# EAGLE design [B]Main board v1.4 (EAGLE 7.1.0)
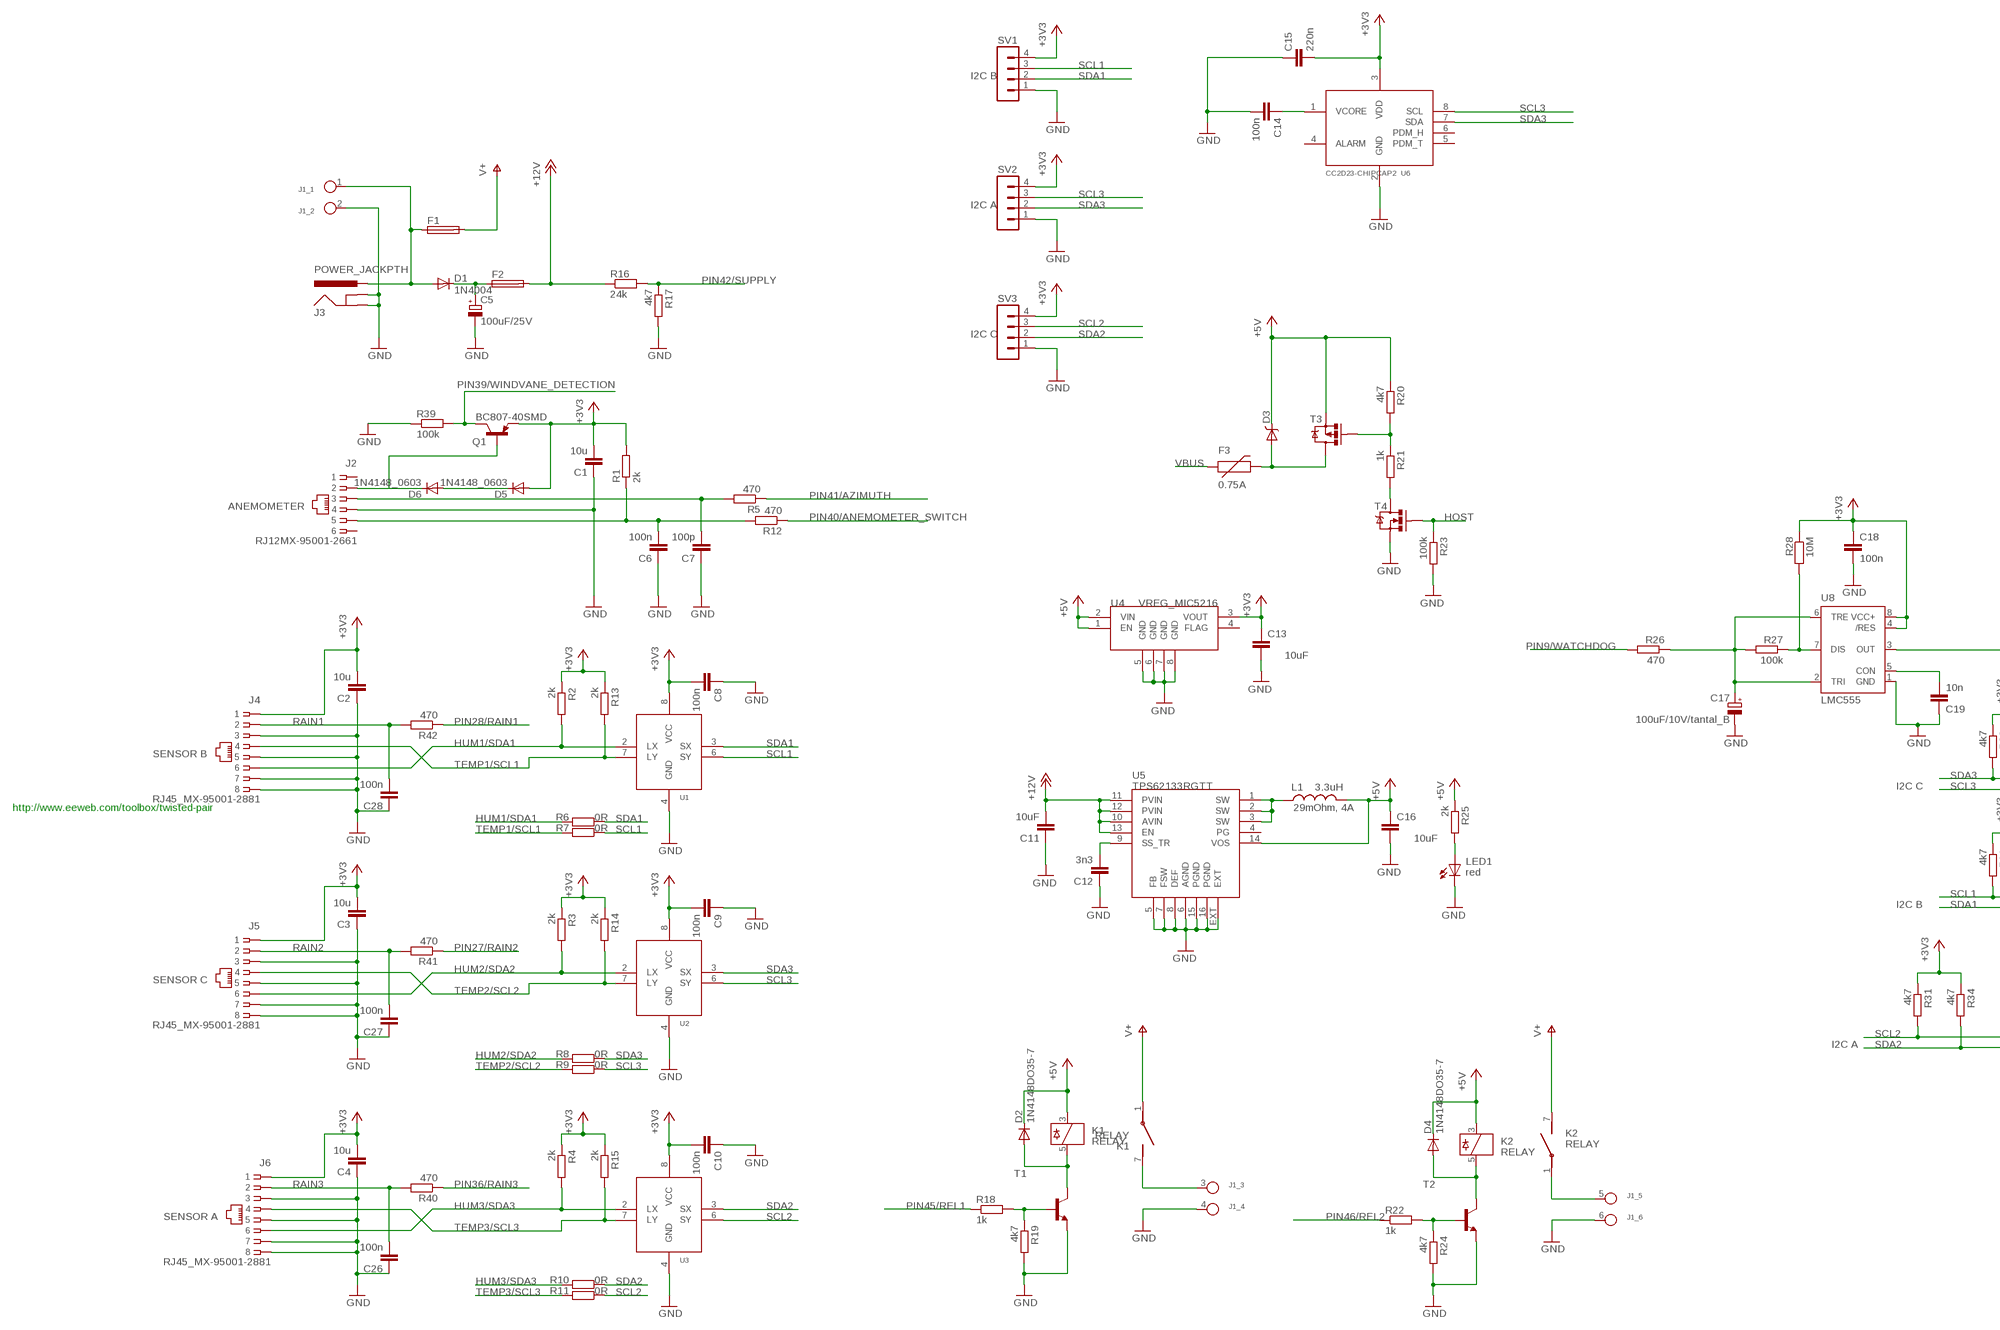
[diagram p0: schematic, sheet 1, part 1 of 2]
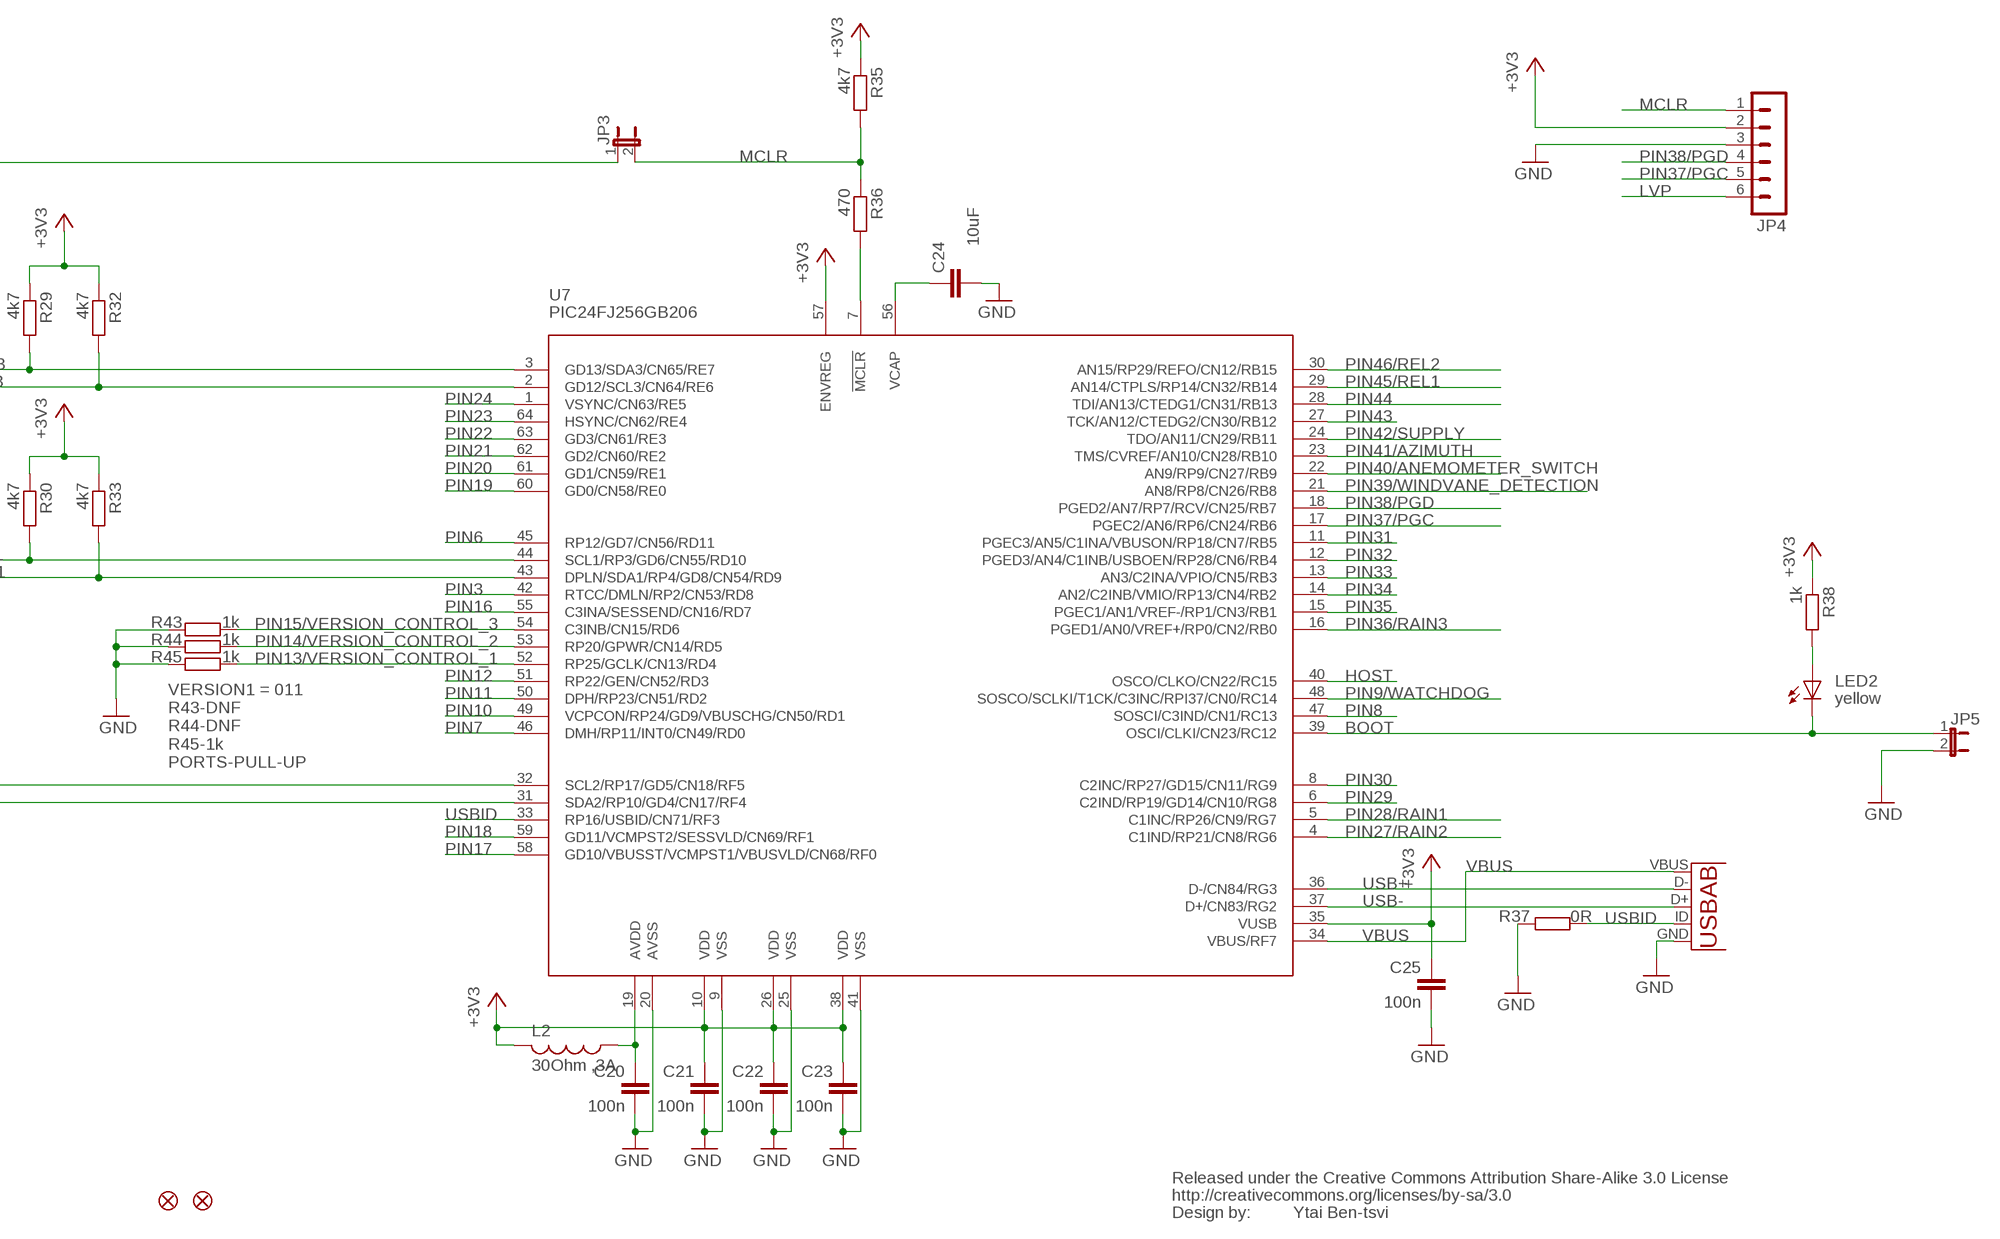
[diagram p1: schematic, sheet 1, part 2 of 2]

## Parts
C1  10u  C-EUC1206  [C1206]
C2  10u  C-EUC1206  [C1206]
C3  10u  C-EUC1206  [C1206]
C4  10u  C-EUC1206  [C1206]
C5  100uF/25V  CPOL-EUE2-5  [E2-5]
C6  100n  C-EUC1206  [C1206]
C7  100p  C-EUC1206  [C1206]
C8  100n  C-EUC1206  [C1206]
C9  100n  C-EUC1206  [C1206]
C10  100n  C-EUC1206  [C1206]
C11  10uF  C-EUC1206  [C1206]
C12  3n3  C-EUC1206  [C1206]
C13  10uF  C-EUC1206  [C1206]
C14  100n  C-EUC1206  [C1206]
C15  220n  C-EUC1206  [C1206]
C16  10uF  C-EUC1206  [C1206]
C17  100uF/10V/tantal_B  CPOL-EUB/3528-21R  [B/3528-21R]
C18  100n  C-EUC1206  [C1206]
C19  10n  C-EUC1206  [C1206]
C20  100n  C-EUC1206  [C1206]
C21  100n  C-EUC1206  [C1206]
C22  100n  C-EUC1206  [C1206]
C23  100n  C-EUC1206  [C1206]
C24  10uF  C-EUC1206  [C1206]
C25  100n  C-EUC1206  [C1206]
C26  100n  C-EUC1206  [C1206]
C27  100n  C-EUC1206  [C1206]
C28  100n  C-EUC1206  [C1206]
D1  1N4004  [DO41-10]
D2  1N4148DO35-7  [DO35-7]
D3  B340A  DIODE-SCHOTTKY_  [SMA-DIODE]
D4  1N4148DO35-7  [DO35-7]
D5  1N4148_0603  [D0603]
D6  1N4148_0603  [D0603]
F1  FUSE_HOLDER  [ZHL30]
F2  FUSE_HOLDER  [ZHL30]
F3  PTCSMD  [PTC-1206]
J1  6P_CONN  [MOLEX_39543-0006]
J2  RJ12MX-95001-2661  [MX-95001-2661]
J3  POWER_JACKPTH  [PC-GK2.1]
J4  RJ45_MX-95001-2881  [MX-95001-2881]
J5  RJ45_MX-95001-2881  [MX-95001-2881]
J6  RJ45_MX-95001-2881  [MX-95001-2881]
J7  10104111-0001LF  USB_AB  [USB-AB-MICRO-SMD]
JP1  FIDUCIALUFIDUCIAL  [MICRO-FIDUCIAL]
JP2  FIDUCIALUFIDUCIAL  [MICRO-FIDUCIAL]
JP3  JUMPER-2PTH  [1X02]
JP4  MA06-1  [MA06-1]
JP5  JUMPER-2PTH  [1X02]
K1  RELAY  [JV-5S-KT]
K2  RELAY  [JV-5S-KT]
L1  VLC5045T-3R3N  INDUCTORCR54  [CR54]
L2  30Ohm ,3A  L-US  [R1206]
LED1  LS L29K-G1J2-1-Z  LED1206  [LED-1206]
LED2  LY L29K-J1K2-26-Z  LED1206  [LED-1206]
Q1  BC807-40SMD  [SOT23-BEC]
R1  2k  R-EU_R1206  [R1206]
R2  2k  R-EU_R1206  [R1206]
R3  2k  R-EU_R1206  [R1206]
R4  2k  R-EU_R1206  [R1206]
R5  470  R-EU_R1206  [R1206]
R6  0R  R-EU_R1206  [R1206]
R7  0R  R-EU_R1206  [R1206]
R8  0R  R-EU_R1206  [R1206]
R9  0R  R-EU_R1206  [R1206]
R10  0R  R-EU_R1206  [R1206]
R11  0R  R-EU_R1206  [R1206]
R12  470  R-EU_R1206  [R1206]
R13  2k  R-EU_R1206  [R1206]
R14  2k  R-EU_R1206  [R1206]
R15  2k  R-EU_R1206  [R1206]
R16  24k  R-EU_R1206  [R1206]
R17  4k7  R-EU_R1206  [R1206]
R18  1k  R-EU_R1206  [R1206]
R19  4k7  R-EU_R1206  [R1206]
R20  4k7  R-EU_R1206  [R1206]
R21  1k  R-EU_R1206  [R1206]
R22  1k  R-EU_R1206  [R1206]
R23  100k  R-EU_R1206  [R1206]
R24  4k7  R-EU_R1206  [R1206]
R25  2k  R-EU_R1206  [R1206]
R26  470  R-EU_R1206  [R1206]
R27  100k  R-EU_R1206  [R1206]
R28  10M  R-EU_R1206  [R1206]
R29  4k7  R-EU_R1206  [R1206]
R30  4k7  R-EU_R1206  [R1206]
R31  4k7  R-EU_R1206  [R1206]
R32  4k7  R-EU_R1206  [R1206]
R33  4k7  R-EU_R1206  [R1206]
R34  4k7  R-EU_R1206  [R1206]
R35  4k7  R-EU_R1206  [R1206]
R36  470  R-EU_R1206  [R1206]
R37  0R  R-EU_R1206  [R1206]
R38  1k  R-EU_R1206  [R1206]
R39  100k  R-EU_R1206  [R1206]
R40  470  R-EU_R1206  [R1206]
R41  470  R-EU_R1206  [R1206]
R42  470  R-EU_R1206  [R1206]
R43  1k  R-EU_R1206  [R1206]
R44  1k  R-EU_R1206  [R1206]
R45  1k  R-EU_R1206  [R1206]
SV1  MA04-1  [MA04-1]
SV2  MA04-1  [MA04-1]
SV3  MA04-1  [MA04-1]
T1  BC817-16-NPN-SOT23-BEC  [SOT23-BEC]
T2  BC817-16-NPN-SOT23-BEC  [SOT23-BEC]
T3  IRLML2244  MOSFET-PCHANNELSMD  [SOT23-3]
T4  2N7002PW  MOSFET-NCHANNELSOT323  [SOT323]
U1  P82B715_I2C_BUS_EXTENDER  [SO-08]
U2  P82B715_I2C_BUS_EXTENDER  [SO-08]
U3  P82B715_I2C_BUS_EXTENDER  [SO-08]
U4  VREG_MIC5216  [MSOP8]
U5  TPS62133RGTT  TPS6214X  [QFN16-3X3MM]
U6  CC2D23-CHIPCAP2  [CC2D23-CHIPCAP2]
U7  PIC24FJ256GB206  PIC24FXXXDAX06  [PIC24FXXX_TQFP64]
U8  LMC555  NE555D  [SO08]
U$1  CREATIVE_COMMONS  [CREATIVE_COMMONS]

## Nets
+3V3: C1.2 C2.2 C3.2 C4.2 C8.2 C9.2 C10.2 C13.2 C15.2 C18.1 C21.1 C22.1 C23.1 C25.1 D5.A J4.1 J5.1 J6.1 JP4.2 L2.2 Q1.E R1.2 R2.1 R3.1 R4.1 R13.1 R14.1 R15.1 R28.1 R29.1 R30.1 R31.1 R32.1 R33.1 R34.1 R35.1 R38.1 SV1.4 SV2.4 SV3.4 U1.8(VCC) U2.8(VCC) U3.8(VCC) U4.3(VOUT) U6.3(VDD) U7.10(VDD) U7.26(VDD) U7.35(VUSB) U7.38(VDD) U7.57(ENVREG) U8.4(/RES) U8.8(VCC+)
+5V [VCC]: C16.2 D2.C D3.C D4.C K1.3 K2.3 L1.P$2 R20.1 R25.1 T3.2(S) U4.1(EN) U4.2(VIN) U5.14(VOS)
+12V: C11.2 F2.2 R16.1 U5.10(AVIN) U5.11(PVIN) U5.12(PVIN) U5.13(EN)
BOOT: JP5.1 LED2.C U7.39(OSCI/CLKI/CN23/RC12)
GND [VCC]: C1.1 C2.1 C3.1 C4.1 C5.- C6.1 C7.1 C8.1 C9.1 C10.1 C11.1 C12.1 C13.1 C14.2 C15.1 C16.1 C17.- C18.2 C19.1 C20.2 C21.2 C22.2 C23.2 C24.1 C25.2 C26.1 C27.1 C28.1 J1.2 J1.4 J1.6 J2.4 J3.GND J3.GNDBREAK J4.3 J4.5 J4.7 J4.8 J5.3 J5.5 J5.7 J5.8 J6.3 J6.5 J6.7 J6.8 J7.GND JP4.3 JP5.2 LED1.C R17.2 R19.2 R23.2 R24.2 R37.2 R39.1 R43.1 R44.1 R45.1 SV1.1 SV2.1 SV3.1 T1.E T2.E T4.2(S) U1.4(GND) U2.4(GND) U3.4(GND) U4.5(GND) U4.6(GND) U4.7(GND) U4.8(GND) U5.5(FB) U5.6(AGND) U5.7(FSW) U5.8(DEF) U5.15(PGND) U5.16(PGND) U5.EXT U6.2(GND) U7.9(VSS) U7.20(AVSS) U7.25(VSS) U7.41(VSS) U8.1(GND)
HOST: R23.1 T4.1(G) U7.40(OSCO/CLKO/CN22/RC15)
HUM1/SDA1: J4.6 R2.2 R6.2 U1.2(LX)
HUM2/SDA2: J5.6 R3.2 R8.2 U2.2(LX)
HUM3/SDA3: J6.6 R4.2 R10.2 U3.2(LX)
LVP: JP4.6
MCLR: JP3.2 JP4.1 R35.2 R36.1
N$1: D1.A F1.1 J1.1 J3.PWR
N$2: C6.2 J2.5 R1.1 R12.2
N$3: C5.+ D1.C F2.1
N$4: C7.2 J2.3 R5.2
N$6: C14.1 U6.1(VCORE)
N$9: R36.2 U7.7(!MCLR)
N$10: JP3.1 U8.3(OUT)
N$11: R18.2 R19.1 T1.B
N$12: D2.A K1.5 T1.C
N$13: C19.2 U8.5(CON)
N$15: D6.C J2.2 Q1.B
N$16: J1.3 K1.7(2:S)
N$17: C17.+ R26.1 R27.2 U8.2(TRI) U8.6(TRE)
N$18: D5.C D6.A
N$19: R27.1 R28.2 U8.7(DIS)
N$20: R22.2 R24.1 T2.B
N$21: D4.A K2.5 T2.C
N$22: C24.2 U7.56(VCAP)
N$23: J1.5 K2.1(2:P)
N$24: LED2.A R38.2
N$25: LED1.A R25.2
N$26: D3.A F3.2 T3.3(D)
N$27: C12.2 U5.9(SS_TR)
N$28: L1.P$1 U5.1(SW) U5.2(SW) U5.3(SW)
N$29: C20.1 L2.1 U7.19(AVDD)
N$30: R20.2 R21.1 T3.1(G)
N$31: R21.2 T4.3(D)
PIN3: U7.42(RTCC/DMLN/RP2/CN53/RD8)
PIN6: U7.45(RP12/GD7/CN56/RD11)
PIN7: U7.46(DMH/RP11/INT0/CN49/RD0)
PIN8: U7.47(SOSCI/C3IND/CN1/RC13)
PIN9/WATCHDOG: R26.2 U7.48(SOSCO/SCLKI/T1CK/C3INC/RPI37/CN0/RC14)
PIN10: U7.49(VCPCON/RP24/GD9/VBUSCHG/CN50/RD1)
PIN11: U7.50(DPH/RP23/CN51/RD2)
PIN12: U7.51(RP22/GEN/CN52/RD3)
PIN13/VERSION_CONTROL_1: R45.2 U7.52(RP25/GCLK/CN13/RD4)
PIN14/VERSION_CONTROL_2: R44.2 U7.53(RP20/GPWR/CN14/RD5)
PIN15/VERSION_CONTROL_3: R43.2 U7.54(C3INB/CN15/RD6)
PIN16: U7.55(C3INA/SESSEND/CN16/RD7)
PIN17: U7.58(GD10/VBUSST/VCMPST1/VBUSVLD/CN68/RF0)
PIN18: U7.59(GD11/VCMPST2/SESSVLD/CN69/RF1)
PIN19: U7.60(GD0/CN58/RE0)
PIN20: U7.61(GD1/CN59/RE1)
PIN21: U7.62(GD2/CN60/RE2)
PIN22: U7.63(GD3/CN61/RE3)
PIN23: U7.64(HSYNC/CN62/RE4)
PIN24: U7.1(VSYNC/CN63/RE5)
PIN27/RAIN2: R41.1 U7.4(C1IND/RP21/CN8/RG6)
PIN28/RAIN1: R42.1 U7.5(C1INC/RP26/CN9/RG7)
PIN29: U7.6(C2IND/RP19/GD14/CN10/RG8)
PIN30: U7.8(C2INC/RP27/GD15/CN11/RG9)
PIN31: U7.11(PGEC3/AN5/C1INA/VBUSON/RP18/CN7/RB5)
PIN32: U7.12(PGED3/AN4/C1INB/USBOEN/RP28/CN6/RB4)
PIN33: U7.13(AN3/C2INA/VPIO/CN5/RB3)
PIN34: U7.14(AN2/C2INB/VMIO/RP13/CN4/RB2)
PIN35: U7.15(PGEC1/AN1/VREF-/RP1/CN3/RB1)
PIN36/RAIN3: R40.1 U7.16(PGED1/AN0/VREF+/RP0/CN2/RB0)
PIN37/PGC: JP4.5 U7.17(PGEC2/AN6/RP6/CN24/RB6)
PIN38/PGD: JP4.4 U7.18(PGED2/AN7/RP7/RCV/CN25/RB7)
PIN39/WINDVANE_DETECTION: Q1.C R39.2 U7.21(AN8/RP8/CN26/RB8)
PIN40/ANEMOMETER_SWITCH: R12.1 U7.22(AN9/RP9/CN27/RB9)
PIN41/AZIMUTH: R5.1 U7.23(TMS/CVREF/AN10/CN28/RB10)
PIN42/SUPPLY: R16.2 R17.1 U7.24(TDO/AN11/CN29/RB11)
PIN43: U7.27(TCK/AN12/CTEDG2/CN30/RB12)
PIN44: U7.28(TDI/AN13/CTEDG1/CN31/RB13)
PIN45/REL1: R18.1 U7.29(AN14/CTPLS/RP14/CN32/RB14)
PIN46/REL2: R22.1 U7.30(AN15/RP29/REFO/CN12/RB15)
RAIN1: C28.2 J4.2 R42.2
RAIN2: C27.2 J5.2 R41.2
RAIN3: C26.2 J6.2 R40.2
SCL1: R7.1 R30.2 SV1.3 U1.6(SY) U7.44(SCL1/RP3/GD6/CN55/RD10)
SCL2: R11.1 R31.2 SV3.3 U3.6(SY) U7.32(SCL2/RP17/GD5/CN18/RF5)
SCL3: R9.1 R32.2 SV2.3 U2.6(SY) U6.8(SCL) U7.2(GD12/SCL3/CN64/RE6)
SDA1: R6.1 R33.2 SV1.2 U1.3(SX) U7.43(DPLN/SDA1/RP4/GD8/CN54/RD9)
SDA2: R10.1 R34.2 SV3.2 U3.3(SX) U7.31(SDA2/RP10/GD4/CN17/RF4)
SDA3: R8.1 R29.2 SV2.2 U2.3(SX) U6.7(SDA) U7.3(GD13/SDA3/CN65/RE7)
TEMP1/SCL1: J4.4 R7.2 R13.2 U1.7(LY)
TEMP2/SCL2: J5.4 R9.2 R14.2 U2.7(LY)
TEMP3/SCL3: J6.4 R11.2 R15.2 U3.7(LY)
USB+: J7.D- U7.36(D-/CN84/RG3)
USB-: J7.D+ U7.37(D+/CN83/RG2)
USBID: J7.ID(USBID) R37.1 U7.33(RP16/USBID/CN71/RF3)
V+: F1.2 K1.1(2:P) K2.7(2:S)
VBUS: F3.1 J7.VBUS U7.34(VBUS/RF7)
Unconnected: J2.1 J2.6 U4.4(FLAG) U5.4(PG) U6.4(ALARM) U6.5(PDM_T) U6.6(PDM_H)

## Notes on the sheet
- I2C B
- I2C A
- I2C C
- 0.75A
- ANEMOMETER
- SENSOR B
- I2C C
- http://www.eeweb.com/toolbox/twisted-pair | 29mOhm, 4A
- red
- I2C B
- SENSOR C
- yellow
- VERSION1 = 011
  R43-DNF
  R44-DNF
  R45-1k
  PORTS-PULL-UP
- I2C A
- SENSOR A
- Ytai Ben-tsvi

## Library data of the parts
C1-C4 C6-C16 C18-C28 = rcl:C-EU: CAPACITOR, European symbol
C5 = Thomas Egnal Library:CPOL-EU: POLARIZED CAPACITOR, European symbol
C17 = rcl:CPOL-EU: POLARIZED CAPACITOR, European symbol
D1 = diode:1N4004: DIODE general purpose rectifier, 1 A
D2 D4 = diode:1N4148: DIODE high speed (Philips)
D3 = SparkFun-DiscreteSemi:DIODE-SCHOTTKY: Commonly MBRA140.; PART#: B340A
D5 D6 = Thomas Egnal Library:1N4148: DIODE high speed (Philips); LINK: http://www.tme.eu/pl/details/1n4148-0603/diody-uniwersalne-smd/dc-components/cd4148wt0603c/; VENDOR: TME
F1 F2 = Thomas Egnal Library:FUSE_HOLDER: http://www.tme.eu/pl/details/zhl30/bezpieczniki-gniazda-pcb/#t735977d29e6b3d766657895563ce61ae
F3 = SparkFun-PowerIC:PTC: Resettable Fuse PTC Resettable Fuse. Spark Fun Electronics SKU : COM-08357; PART#: 0ZCA0075FF2G
J1 = Thomas Egnal Library:6P_CONN
J2 = Thomas Egnal Library:RJ12: CORCOM Modular RJ Jacks No Shield Source: https://www.elfa.se/elfa3~se_sv/elfa/init.do?item=42-696-27&toc=0&q=42-696-27; LINK: http://www.tme.eu/pl/katalog/?idp=1&search=mx-95001-2661&cleanParameters=1; VENDOR: TME
J3 = Thomas Egnal Library:POWER_JACK: Power Jack This is the standard 5.5mm barrel jack for power. The PTH is the most common, proven, reliable, footprint. All others are experimental. The Slot footprint only works if the mill layer is transmitted to the PCB fab house so be warned. Spark Fun Electronics SKU : PRT-00119. Mating wall wart : TOL-00298 (and others)
J4-J6 = Thomas Egnal Library:RJ45; LINK: http://www.tme.eu/pl/details/mx-95501-2881/zlacza-rj/molex/95501-2881/; VENDOR: TME
J7 = SparkFun-Connectors:USB_AB: This is a USB AB connector that is compatible with USB OTG. i.e. this connector can serve as a host or device
JP1 JP2 = SparkFun:FIDUCIAL: Fiducial Alignment Points Various fiducial points for machine vision alignment.
JP3 JP5 = SparkFun:JUMPER-2: Jumper Basic 0.1" spaced jumper. Use with breakaway headers.
JP4 = con-lstb:MA06-1: PIN HEADER; OC_FARNELL: unknown; OC_NEWARK: unknown
K1 K2 = Thomas Egnal Library:RELAY: JV-5S-KT http://www.tme.eu/pl/details/jv-5s-kt/przekazniki-elektromagn-miniaturowe/fujitsu-takamisawa/#
L1 = SparkFun-Passives:INDUCTOR: Inductors Basic Inductor/Choke - 0603 and 1206. Footprints are not proven and vary greatly between part numbers.; AM: 3.3uH
L2 = rcl:L-US: INDUCTOR, American symbol
LED1 LED2 = SparkFun:LED: LEDs Standard schematic elements and footprints for 5mm, 3mm, 1206, and 0603 sized LEDs. 5mm - Spark Fun Electronics SKU : COM-00529 (and others)
Q1 = transistor-pnp:BC807*: PNP Transistror
R1-R45 = rcl:R-EU_: RESISTOR, European symbol
SV1-SV3 = con-lstb:MA04-1: PIN HEADER; OC_FARNELL: unknown; OC_NEWARK: unknown
T1 T2 = transistor:*-NPN-: NPN Transistror BF959 corrected 2008.03.06
T3 = SparkFun-DiscreteSemi:MOSFET-PCHANNEL: Generic PMOSFET
T4 = SparkFun-DiscreteSemi:MOSFET-NCHANNEL: Generic NMOS footprint; PART#: 2N7002PW
U1-U3 = Thomas Egnal Library:P82B715_I2C_BUS_EXTENDER
U4 = SparkFun-PowerIC:VREG_MIC5216: 500mA LDO, MSOP8 for better dissipation
U5 = SparkFun-PowerIC:TPS6214X: 3-17V, 2A Step Down Converter
U6 = Thomas Egnal Library:CC2D23-CHIPCAP2
U7 = SparkFun-DigitalIC:PIC24FXXXDAX06: PIC24FXXXDAX06 PIC24FXXXDA106 / PIC24FXXXDA206
U8 = SparkFun:NE555: General purpose bipolar Timer
U$1 = SparkFun-Aesthetics:CREATIVE_COMMONS: Creative Commons License summary

## Net classes
1 VCC: width 1.27 mm, clearance 0.254 mm

## Board
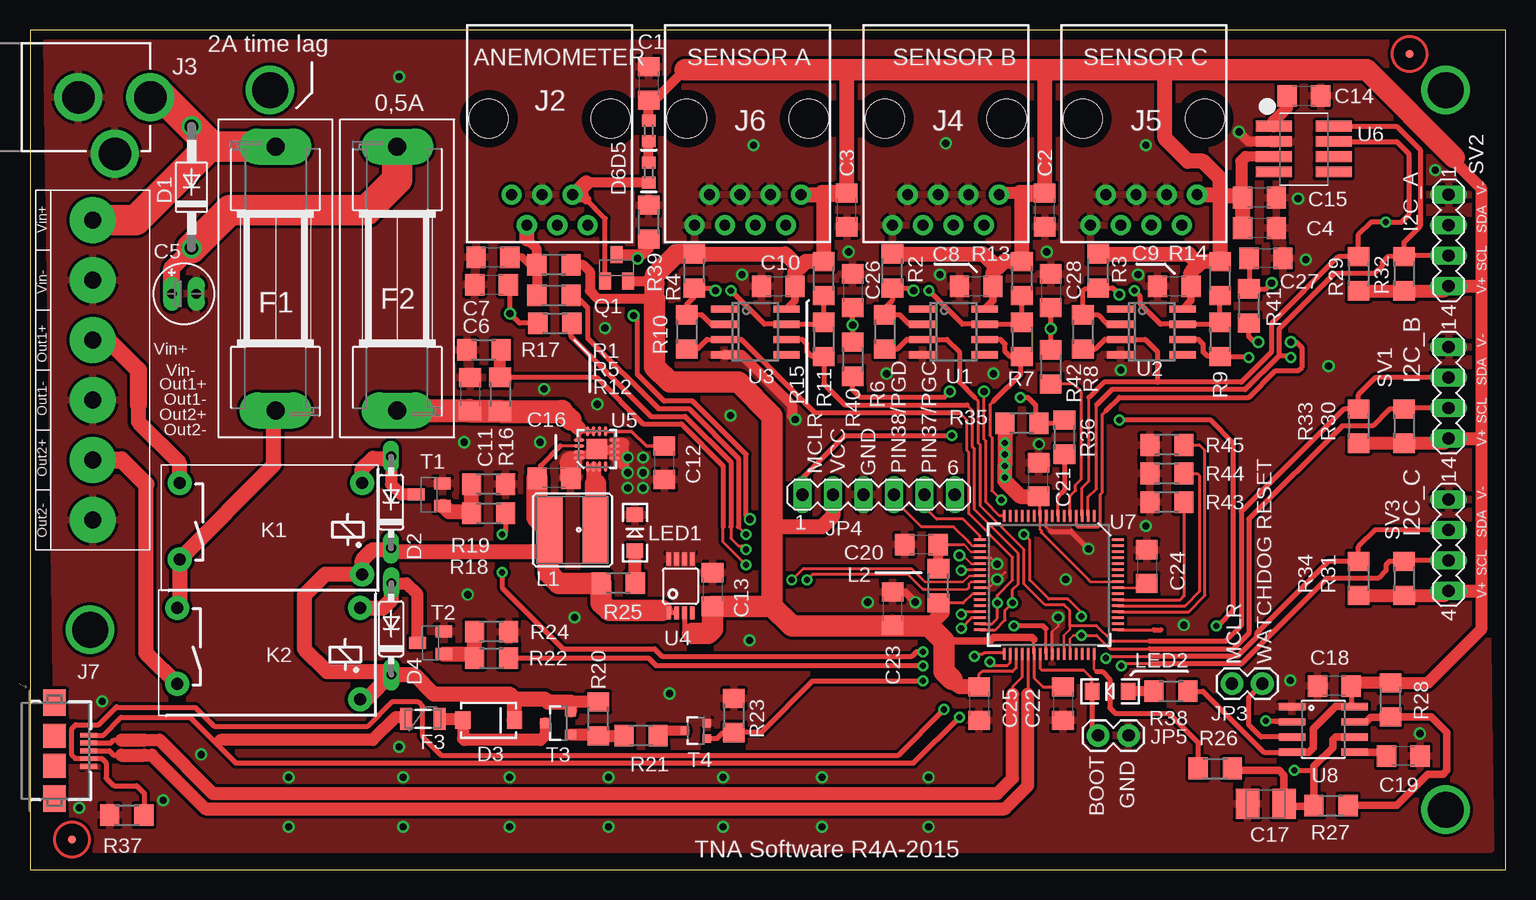
[diagram p2: board, top side]
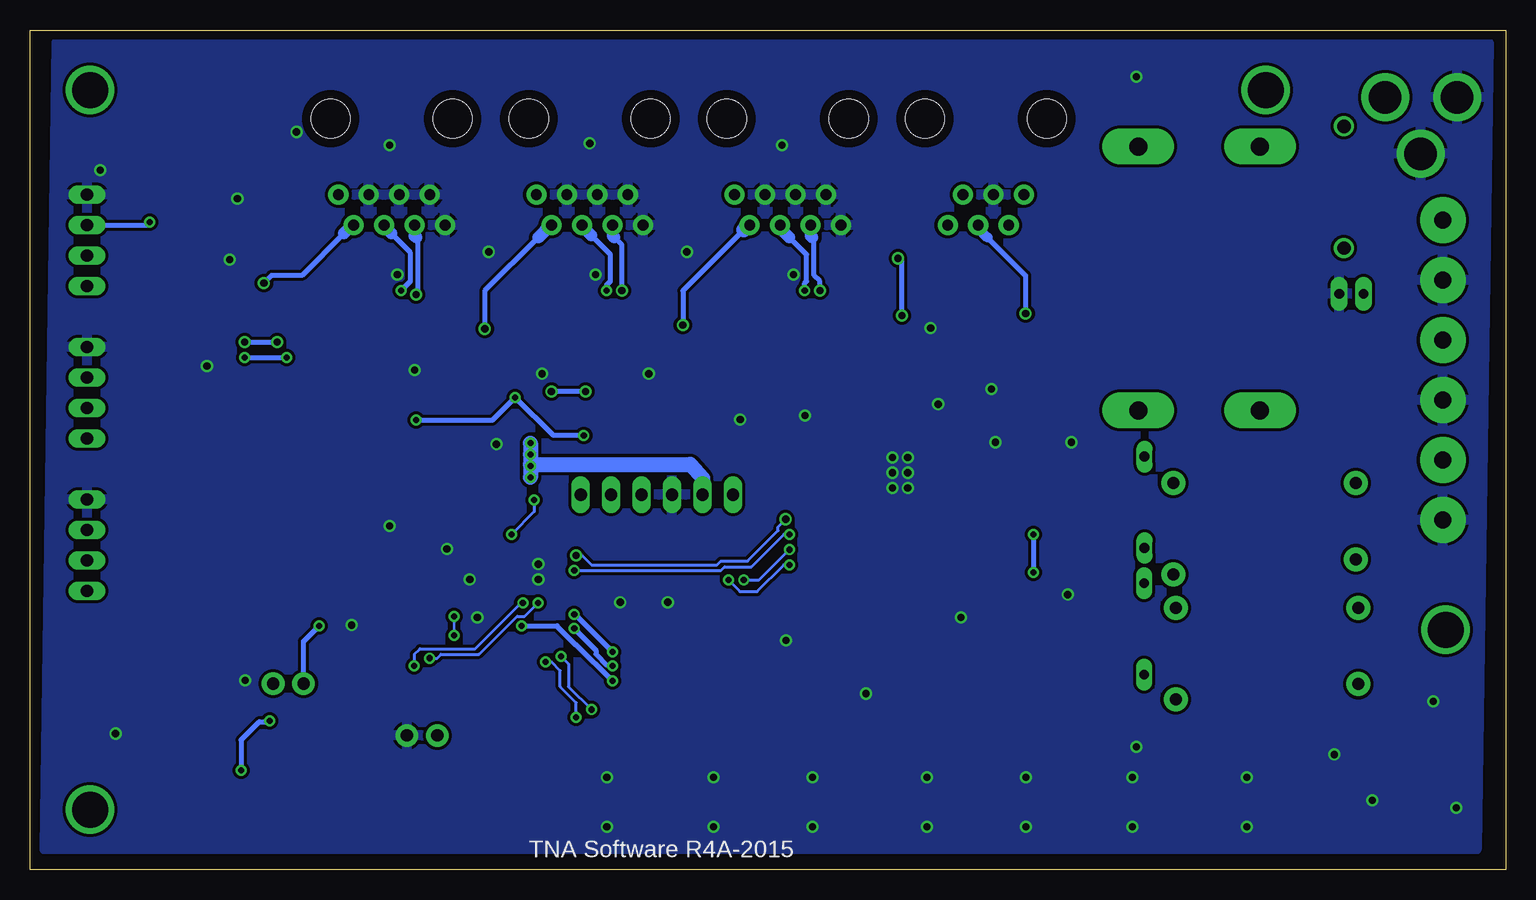
[diagram p3: board, bottom side, seen from below]

Size 123 x 70 mm. Coordinates in mm from the lower left corner, seen from the top.
Outline: 0,0 123,0 123,70 0,70 0,0
Copper layers (1*16): Top 0.035mm / dielectric 1.5mm / Bottom 0.035mm
Design rules "default *": minimum track width 8mil, minimum drill 20mil, track to track 8mil, track to pad 8mil, pad to pad 8mil, via to via 8mil, smd to smd 8mil, copper to edge 30mil, drill to drill 8mil, minimum pad ring 10mil, minimum via ring 8mil, stop-mask expansion 4mil, vias tented up to drill 0mil, thermal gap 10mil

### Footprints (pad centres in the part's own frame; a part is rotated, then mirrored left to right if it is on the bottom)
C1206 = smd 1.6 x 1.8: 1 -1.4,0; 2 1.4,0
E2-5 = drill 0.813 pad 1.397 long: + -1.016,0; - 1.016,0
B/3528-21R = smd 1.95 x 2.5: + 1.525,0; - -1.525,0
DO41-10 = drill 1.118: A 5.08,0; C -5.08,0
DO35-7 = drill 0.813 long: A 3.81,0; C -3.81,0
SMA-DIODE = smd 1.27 x 1.47: A -2.15,0; C 2.15,0
D0603 = smd 1 x 1.1: A 0.85,0; C -0.85,0
ZHL30 = drill 1.5 pad 3 long: 1 -11,0; 2 11,0
PTC-1206 = smd 1 x 1.8: 1 -1.4,0; 2 1.4,0
MOLEX_39543-0006 = drill 1.4 pad 3.81: 1 -12.5,0; 2 -7.5,0; 3 -2.5,0; 4 2.5,0; 5 7.5,0; 6 12.5,0
MX-95001-2661 = drill 0.9 pad 1.676: 1 -3.175,8.89; 2 -1.905,6.35; 3 -0.635,8.89; 4 0.635,6.35; 5 1.905,8.89; 6 3.175,6.35 | hole 3.251: -5.08,0; 5.08,0
PC-GK2.1 = drill 2.7 pad 4: GND 0,7.7; GNDBREAK 4.7,10.75; PWR 0,13.7
MX-95001-2881 = drill 0.9 pad 1.676: 1 -4.445,6.35; 2 -3.175,8.89; 3 -1.905,6.35; 4 -0.635,8.89; 5 0.635,6.35; 6 1.905,8.89; 7 3.175,6.35; 8 4.445,8.89 | hole 3.251: -5.08,0; 5.08,0
USB-AB-MICRO-SMD = smd 1.4 x 0.4: D+ 2.85,0; D- 2.85,0.65; GND 2.85,-1.3; ID 2.85,-0.65; VBUS 2.85,1.3 | smd 1.9 x 2: P$6 0,1.25; P$7 0,-1.25 | smd 1.9 x 2.2: P$8 0,4; P$9 0,-4
MICRO-FIDUCIAL = smd 0.635 x 0.635: 1 0,0
1X02 = drill 1.016 pad 1.88: 1 0,0; 2 2.54,0
MA06-1 = drill 1.016 long: 1 -6.35,0; 2 -3.81,0; 3 -1.27,0; 4 1.27,0; 5 3.81,0; 6 6.35,0
JV-5S-KT = drill 1 pad 2: 1 16.57,7.54; 3 1.33,8.81; 5 1.33,1.19; 7 16.57,1.19
CR54 = smd 5.5 x 2.15: P$1 0,1.92; P$2 0,-1.92
R1206 = smd 1.6 x 1.803: 1 -1.422,0; 2 1.422,0
LED-1206 = smd 1.2 x 1.4: A -1.5,0; C 1.5,0
SOT23-BEC = smd 1 x 1.4: B -0.95,-1.1; C 0,1.1; E 0.95,-1.1
MA04-1 = drill 1.016 long: 1 -3.81,0; 2 -1.27,0; 3 1.27,0; 4 3.81,0
SOT23-3 = smd 0.8 x 0.9: 1 -0.95,-1; 2 0.95,-1; 3 0,1.1
SOT323 = smd 0.7 x 0.7: 1 -0.65,-0.925; 2 0.65,-0.925; 3 0,0.925
SO-08 = smd 0.6 x 2.2: 1 -1.905,-2.6; 2 -0.635,-2.6; 3 0.635,-2.6; 4 1.905,-2.6; 5 1.905,2.6; 6 0.635,2.6; 7 -0.635,2.6; 8 -1.905,2.6
MSOP8 = smd 0.4 x 1.1: 1 -0.975,-2.25; 2 -0.325,-2.25; 3 0.325,-2.25; 4 0.975,-2.25; 5 0.975,2.25; 6 0.325,2.25; 7 -0.325,2.25; 8 -0.975,2.25
QFN16-3X3MM = smd 0.85 x 0.28: 1 -1.475,0.75; 2 -1.475,0.25; 3 -1.475,-0.25; 4 -1.475,-0.75; 9 1.475,-0.75; 10 1.475,-0.25; 11 1.475,0.25; 12 1.475,0.75 | smd 0.28 x 0.85: 5 -0.75,-1.475; 6 -0.25,-1.475; 7 0.25,-1.475; 8 0.75,-1.475; 13 0.75,1.475; 14 0.25,1.475; 15 -0.25,1.475; 16 -0.75,1.475 | smd 1.68 x 1.68: EXT 0,0
CC2D23-CHIPCAP2 = smd 3 x 0.9: 1 -2.5,1.905; 2 -2.5,0.635; 3 -2.5,-0.635; 4 -2.5,-1.905; 5 2.5,-1.905; 6 2.5,-0.635; 7 2.5,0.635; 8 2.5,1.905
PIC24FXXX_TQFP64 = smd 0.22 x 1: 1 -3.75,-5.75; 2 -3.25,-5.75; 3 -2.75,-5.75; 4 -2.25,-5.75; 5 -1.75,-5.75; 6 -1.25,-5.75; 7 -0.75,-5.75; 8 -0.25,-5.75; 9 0.25,-5.75; 10 0.75,-5.75; 11 1.25,-5.75; 12 1.75,-5.75; 13 2.25,-5.75; 14 2.75,-5.75; 15 3.25,-5.75; 16 3.75,-5.75; 33 3.75,5.75; 34 3.25,5.75; 35 2.75,5.75; 36 2.25,5.75; 37 1.75,5.75; 38 1.25,5.75; 39 0.75,5.75; 40 0.25,5.75; 41 -0.25,5.75; 42 -0.75,5.75; 43 -1.25,5.75; 44 -1.75,5.75; 45 -2.25,5.75; 46 -2.75,5.75; 47 -3.25,5.75; 48 -3.75,5.75 | smd 1 x 0.22: 17 5.75,-3.75; 18 5.75,-3.25; 19 5.75,-2.75; 20 5.75,-2.25; 21 5.75,-1.75; 22 5.75,-1.25; 23 5.75,-0.75; 24 5.75,-0.25; 25 5.75,0.25; 26 5.75,0.75; 27 5.75,1.25; 28 5.75,1.75; 29 5.75,2.25; 30 5.75,2.75; 31 5.75,3.25; 32 5.75,3.75; 49 -5.75,3.75; 50 -5.75,3.25; 51 -5.75,2.75; 52 -5.75,2.25; 53 -5.75,1.75; 54 -5.75,1.25; 55 -5.75,0.75; 56 -5.75,0.25; 57 -5.75,-0.25; 58 -5.75,-0.75; 59 -5.75,-1.25; 60 -5.75,-1.75; 61 -5.75,-2.25; 62 -5.75,-2.75; 63 -5.75,-3.25; 64 -5.75,-3.75
SO08 = smd 0.61 x 2.21: 1 -1.905,-2.616; 2 -0.635,-2.616; 3 0.635,-2.616; 4 1.905,-2.616; 5 1.905,2.616; 6 0.635,2.616; 7 -0.635,2.616; 8 -1.905,2.616

### Placement (x,y rotation side)
C1  51.58,65.55 270 top
C2  84.59,54.99 90 top
C3  68.08,54.99 90 top
C4  102.49,53.48 180 top
C5  12.84,48.01 0 top
C6  38.59,51.05 0 top
C7  38.48,48.76 0 top
C8  78.88,48.64 0 top
C9  95.39,48.64 0 top
C10  62.37,48.64 0 top
C11  36.69,39.62 270 top
C12  52.88,33.91 90 top
C13  56.9,23.36 270 top
C14  106.19,64.52 0 top
C15  102.49,56.02 180 top
C16  43.67,32.64 180 top
C17  103.01,5.46 0 top
C18  108.72,15.3 180 top
C19  114.48,9.46 180 top
C20  74.31,27.08 180 top
C21  84.08,32.52 90 top
C22  86.11,13.83 270 top
C23  71.91,21.75 90 top
C24  93.09,25.26 270 top
C25  79.12,13.83 270 top
C26  68.58,48.26 270 top
C27  103.03,50.96 180 top
C28  85.09,48.26 270 top
D1  13.47,56.9 90 top
D2  30.1,30.62 90 top
D3  38.24,12.45 0 top
D4  30.12,20.07 90 top
D5  51.58,61.59 90 top
D6  51.58,58.1 90 top
F1  20.46,49.27 270 top
F2  30.62,49.27 270 top
F3  32.77,12.56 0 top
J1  5.22,41.66 270 top
J2  43.32,62.61 180 top
J3  -3.67,64.38 270 top
J4  76.34,62.61 180 top
J5  92.85,62.61 180 top
J6  59.83,62.61 180 top
J7  2.04,9.9 0 top
JP1  3.5,2.5 0 top
JP2  115,68 0 top
JP3  102.73,15.49 180 top
JP4  70.74,31.25 0 top
JP5  89.04,11.18 0 top
K1  29.04,33.41 180 top
K2  28.83,23 180 top
L1  45.23,28.32 270 top
L2  75.72,23.65 270 top
LED1  50.42,28.08 90 top
LED2  90.03,14.86 180 top
Q1  48.9,50.16 0 top
R1  43.67,50.42 0 top
R2  71.89,49.91 270 top
R3  89.04,49.91 270 top
R4  55.38,49.91 270 top
R5  43.75,45.54 180 top
R6  71.26,44.83 90 top
R7  82.69,44.2 90 top
R8  87.77,44.83 90 top
R9  99.2,44.2 90 top
R10  54.75,44.83 90 top
R11  66.18,44.2 90 top
R12  43.67,47.88 180 top
R13  82.69,49.27 270 top
R14  99.2,49.27 270 top
R15  66.18,49.27 270 top
R16  39.19,39.62 90 top
R17  37.85,43.32 180 top
R18  38.23,29.7 180 top
R19  38.23,32.13 0 top
R20  47.37,12.56 270 top
R21  50.94,11.18 0 top
R22  38.48,17.64 180 top
R23  58.67,12.84 90 top
R24  38.48,19.82 0 top
R25  49.03,23.88 0 top
R26  98.81,8.43 180 top
R27  108.44,5.33 180 top
R28  113.41,14.15 270 top
R29  110.75,49.67 90 top
R30  114.56,36.97 90 top
R31  114.56,24.27 90 top
R32  114.56,49.67 90 top
R33  110.75,36.97 90 top
R34  110.75,24.27 90 top
R35  82.69,37.21 0 top
R36  86.23,36.05 270 top
R37  8.08,4.54 180 top
R38  95.11,14.86 180 top
R39  51.58,53.98 270 top
R40  68.58,42.55 90 top
R41  101.6,46.99 90 top
R42  85.09,41.91 90 top
R43  94.77,30.64 0 top
R44  94.77,33.02 0 top
R45  94.77,35.4 0 top
SV1  118.25,39.75 270 top
SV2  118.25,52.45 270 top
SV3  118.25,27.05 270 top
T1  33.27,31.25 90 top
T2  33.4,18.91 90 top
T3  44.07,12.21 90 top
T4  55.5,11.57 90 top
U1  76.97,44.83 270 top
U2  93.48,44.83 270 top
U3  60.47,44.83 270 top
U4  54.23,23.64 0 top
U5  47.24,35.06 90 top
U6  106.19,60.07 0 top
U7  84.95,23.75 180 top
U8  107.81,11.69 270 top
U$1  130.31,-0.26 0 top  (outside the outline)

### Tracks (layer width: path | path; a pad name or v marks a point on that pad's centre or on a via)
+3V3  (via drill 0.51)
  Top 0.203: U7.10 84.2,28.35 84.3,28.26 | U7.57 88.39,24 88.27,24.13
  Top 0.254: U7.35 82.2,16.8 81.92,16.51 79.38,16.51 79.12,16.25 C25.1 | 83.7,19.17 U7.38 83.7,15.99 84.45,15.24 86.09,15.24 C22.1 | U7.10 84.2,31.64 C21.1 | U7.26 78.56,23 77.79,22.23 76.05,22.23 L2.2 | 84.3,28.26 84.3,28.1 88.27,24.13
  Top 0.406: U4.3 54.55,19.74 54.61,19.68 54.61,20.32 55.24,20.32 55.24,19.68 | C18.1 110.12,13.89 U8.8 | U8.4 102.87,9.78 97.79,14.86 R38.1 | 81.28,33.78 v81.28,33.66 v81.28,32.7
  Top 0.61: U8.8 108.84,13.59 107,11.75 107,10.16 106.62,9.78 U8.4 | C8.2 80.28,47.44 U1.8 | C10.2 63.77,47.44 U3.8 | C9.2 96.79,47.44 U2.8 | 76.2,19.05 80.01,19.05 80.3,19.34 83.53,19.34 83.7,19.17
  Top 0.813: U6.3 101.34,59.44 | Q1.E 51.9,49.06 52.07,48.9 | R1.2 46.1,50.42 46.67,49.85 46.67,48.26 47.31,47.62 51.75,47.62 51.91,47.78 52.07,47.62 | D5.A C1.2 52.08,64.14 54.61,66.67
  Top 1.016: 118.75,59.37 118.75,59.05 120.97,56.83 120.97,48.9 120.97,36.2 120.97,23.5 120.97,20 116.53,15.57 R28.1 110.39,15.57 C18.1 | 61.59,26.67 61.59,23.13 61.87,22.86 | 101.34,59.44 100.97,59.05 100.97,56.15 C15.2 | 82.55,56.39 80.92,56.39 J4.1
  Top 1.067: 120.97,48.9 120.71,48.64 SV2.4 117.86,48.25 R32.1 R29.1 | R33.1 R30.1 117.86,35.55 SV1.4 120.71,35.94 120.97,36.2 | 120.97,23.5 120.71,23.24 SV3.4 117.86,22.85 R31.1 R34.1
  Top 1.27: C2.2 84.59,66.53 84.45,66.67 | C3.2 68.08,66.53 67.94,66.67 | 101.11,66.53 100.97,66.67 | 66.18,55.88 R15.1 64.67,50.7 64.14,50.16 | 66.18,55.88 66.18,56.25 66.04,56.39 | C10.2 63.77,49.8 64.14,50.16 | R4.1 62.97,51.33 64.14,50.16 | 82.55,56.39 82.69,56.25 R13.1 81.18,50.7 80.64,50.16 | 80.64,50.16 80.28,49.8 C8.2 | R2.1 79.48,51.33 80.64,50.16 | C9.2 96.79,49.8 97.47,50.48 | R14.1 97.69,50.7 97.47,50.48 | R3.1 96.62,51.33 97.47,50.48 | C25.1 77.48,15.23 76.83,15.88 | L2.2 76.04,21.43 74.93,20.32 | JP4.2 66.93,29.46 66.04,28.57 61.87,28.57 | R35.1 81.27,33.64 | 81.27,33.64 81.27,32.4 82.55,31.11 84.06,31.11 C21.1 | 81.27,33.64 81.28,33.78 | 94.61,66.67 94.61,60.96 96.52,59.05 97.79,59.05 99.2,57.65 99.2,56.52 | C4.2 C15.2 | 99.3,50.8 R14.1 | J6.1 65.8,56.26 66.18,55.88 | 99.2,56.52 99.2,55.88 | 99.2,55.88 R14.1 | J5.1 98.94,56.26 99.2,56.52 | 100.97,56.15 99.47,56.15 99.2,55.88
  Top 1.422: 66.04,56.39 C3.2 | 82.55,56.39 C2.2
  Top 1.676: 52.07,47.62 52.07,48.9 52.07,49.53 53.87,51.33 R4.1
  Top 1.778: 61.87,21.95 C13.2 56.9,20.07 56.52,19.68 55.24,19.68 | 54.61,66.67 67.94,66.67 84.45,66.67 94.61,66.67 100.97,66.67 111.44,66.67 118.75,59.37 | 61.87,21.95 63.5,20.32 72.58,20.32 | 76.83,15.88 76.2,16.51 76.2,19.05 74.93,20.32 72.58,20.32 | 61.87,21.95 61.87,22.86 61.87,28.57 61.87,37.83 59.05,40.64 53.34,40.64 52.07,41.91 52.07,47.62 | 72.58,20.32 C23.1
  Bottom 1.27: 81.28,33.78 67.94,33.78 66.93,32.64 JP4.2 | v81.28,35.56 v81.28,34.61 81.28,33.78 | 81.28,33.78 v81.28,32.7
+5V
  Top 0.254: U5.14 44.2,35.31
  Top 0.305: 43.81,29.75 43.22,29.14
  Top 0.406: 44.2,35.31 42.55,33.66 42.55,32.91 C16.2 | U4.2 U4.1 52.91,21.39 52.7,21.59
  Top 1.016: 29.8,26.51 30.95,26.51 | 43.18,27.94 43.18,29.46 43.22,29.14 L1.P$2 | D3.C 40.2,12.45 | T3.2 45.09,13.17 45.09,13.97 45.1,13.98 R20.1
  Top 1.27: 29.8,26.51 D2.C 29.96,26.67 28.57,26.67 27.7,25.8 K1.3 24.61,24.61 22.86,22.86 22.86,18.41 24.77,16.51 29.86,16.51 D4.C | 30.95,26.51 43.02,26.51 43.18,26.67 43.18,28.2 L1.P$2 | K2.3 28.05,14.19 D4.C | D3.C 40.39,14.22 | 40.39,14.22 40.01,14.61 33.66,14.61 32.01,16.25 D4.C | 40.39,14.22 42.93,14.22 43.18,13.97 45.09,13.97
  Top 1.778: C16.2 42.29,29.34 L1.P$2 | 43.18,26.67 43.18,24.77 44.07,23.88 R25.1 47.61,22.24 48.26,21.59 52.7,21.59
+12V
  Top 0.254: U5.13 45.77,35.97 | U5.10 U5.11
  Top 0.305: 45.77,36.78 45.72,36.83
  Top 0.406: U5.11 U5.12 46.01,36.54 45.77,36.78 | 45.77,35.97 45.77,36.78 | 45.77,36.78 45.72,36.83
  Top 1.27: 45.72,36.83 45.09,37.47
  Top 1.778: 44.35,38.2 45.09,37.47
  Top 1.93: F2.2 36.64,38.27 C11.2 39.17,38.23 R16.1 44.35,38.2
BOOT
  Top 0.254: LED2.C 88.53,15.93 87.82,16.64 84.33,16.64 84.2,16.77 U7.39
  Top 0.406: LED2.C 88.53,11.69 JP5.1
GND  (via drill 0.6 pad 0.81)
  Top 0.203: U7.9 84.7,28.58 85.09,28.19 | U7.25 79.93,23.5 v80.63,24.19 80.64,24.18 81.28,24.77 | U7.20 80.09,26 v80.63,25.46 | U7.41 85.2,19.8 85.72,20.32 85.72,21 v85.71,21.02
  Top 0.254: U5.EXT 47.1,34.92 46.99,34.92 46.88,34.81 U5.15 U5.16 45.77,34.37 46,34.59 46.46,34.59 46.46,34.42 46.41,34.37 45.16,34.37 45.11,34.31
  Top 0.305: 45.11,34.31 45.09,34.29 45.09,33.97 45.09,33.66
  Top 0.406: U5.EXT 48.47,35.06 | 85.09,28.19 86.78,28.19 v88.25,26.73
  Top 0.61: C23.2 72.94,23.15 v73.8,22.29
  Top 0.813: U5.6 48.72,34.47 49.53,33.66 49.53,35.56 48.9,35.56 48.9,34.92 47.38,34.92 U5.EXT | U6.2 101.58,60.7 v100.79,61.5 | U3.4 59.31,42.92 63.5,38.73 63.5,37.83 v63.8,37.53
  Top 1.778: C16.1 45.08,33.96 45.09,33.97
  other vias: 76.34,60.55 60.31,60.39 30.78,66.1 59.99,19.11 42.84,40.07 47.29,38.8 108.25,41.97 45.38,21.02 93.01,60.39 11.09,5.78 21.57,7.68 21.57,3.56 31.1,3.56 39.99,3.56 48.24,3.56 57.77,3.56 66.02,3.56 74.91,3.56 14.27,9.59 31.1,7.68 39.99,7.68 48.24,7.68 57.77,7.68 66.02,7.68 74.91,7.68 42.53,35.62 36.18,35.62 4.11,5.14 6.01,14.03 59.35,49.59 75.86,49.59 92.37,49.59 86.34,24.19 30.78,10.22 53.32,14.67 51.1,34.35 49.83,34.35 49.83,33.08 49.83,31.81 51.1,33.08 51.1,31.81 58.4,37.84 69.83,22.29 117.14,58.32 71.42,41.34 80.31,41.34 68.24,51.5 115.87,11.33 105.07,15.78 84.12,35.46 105.71,55.94 84.75,51.5 47.92,45.15 106.34,50.86 96.18,20.38 93.01,28.64 90.94,41.66 36.49,22.92
  pour Top: 120.79,68.96 1.41,68.96 2.41,1.68 121.79,1.68
  pour Bottom: 120.79,68.96 1.41,68.96 2.41,1.68 121.79,1.68
HOST  (via drill 0.51)
  Top 0.254: U7.40 84.7,20.07
  Top 0.406: T4.1 57.27,10.92 57.78,11.43 R23.1 58.69,11.43 60.96,11.43 65.25,15.72 v74.45,15.72 | 84.7,20.07 84.45,20.32 v82.01,20.32
  Bottom 0.406: v82.01,20.32 79.06,20.32 79.06,20.26 77.53,18.73 77.47,18.73 v74.45,15.72
HUM1/SDA1  (via drill 0.6)
  Top 0.406: 71.67,48.26 R2.2 | U1.2 73.28,45.47 72.49,46.25 R6.2 71.26,46.81 71.89,47.45 R2.2 | R2.2 73.43,48.49 v73.66,48.26
  Bottom 0.406: v73.66,48.26 73.66,52.07 74.3,52.7
  Bottom 1.016: J4.6 74.44,52.84 74.3,52.7
HUM2/SDA2  (via drill 0.6)
  Top 0.406: U2.2 89.79,45.47 89,46.25 R8.2 87.77,48.24 87.95,48.42 88.97,48.42 R3.2 90.26,48.49 v90.81,47.94
  Bottom 0.406: 90.81,52.7 90.65,52.55 90.65,48.1 v90.81,47.94
  Bottom 1.016: J5.6 90.94,52.84 90.81,52.7
HUM3/SDA3  (via drill 0.6)
  Top 0.406: U3.2 56.77,45.47 55.98,46.25 R10.2 54.75,47.13 55.38,47.77 R4.2 56.92,48.49 v57.15,48.26
  Bottom 0.406: v57.15,48.26 57.15,49.05 57.63,49.53 57.63,52.55 57.78,52.7
  Bottom 1.016: J6.6 57.92,52.84 57.78,52.7
MCLR  (via drill 0.51)
  Top 0.406: JP4.1 64.39,32.64 67.94,36.2 v76.83,36.2 | v82.55,39.37 83.19,39.37 83.82,38.73 83.82,37.5 R35.2 85.84,37.21 R36.1 | v90.81,37.47 98.42,37.47 100.33,35.56 100.33,21.59 99.06,20.32 v98.9,20.32
  Bottom 0.406: v76.83,36.2 79.38,36.2 v82.55,39.37 84.45,37.47 v90.81,37.47 | JP3.2 100.19,19.03 v98.9,20.32
N$1
  Top 2.54: J3.PWR 11.07,64.38 D1.A 15.06,60.39 | 15.06,60.39 15.18,60.27 F1.1 | J1.1 8.83,54.16 15.06,60.39
N$2
  Top 0.61: C6.2 41.02,51.05 41.66,50.42 R1.1
  Top 0.813: 41.41,52.56 42.25,51.73 R1.1 R12.2
  Top 1.27: J2.5 41.41,52.56
N$3
  Top 1.422: C5.+ 11.82,50.16 D1.C
  Top 2.54: D1.C 16.65,54.99 28.08,54.99 30.62,57.53 F2.1
N$4  (via drill 0.6)
  Top 0.406: C7.2 40.01,47.99 v40.01,46.35 40.82,45.54 R5.2
  Bottom 0.406: 43.18,52.7 40.01,49.53 v40.01,46.35
  Bottom 0.813: 43.95,53.48 43.18,52.7
  Bottom 1.27: 43.95,53.48 J2.3
N$5  (via drill 3 pad 4)
  other vias: 20,65
N$6
  Top 1.016: U6.1 103.69,62.41 104.78,63.5 104.78,64.5 C14.1
N$7  (via drill 3 pad 4)
  other vias: 5,20
N$8  (via drill 3 pad 4)
  other vias: 118,5
N$9
  Top 0.254: U7.7 85.7,31.09
  Top 0.406: 85.7,31.09 86.23,31.62 R36.2
N$10
  Top 0.406: U8.3 102.61,11.05 101.6,12.06 101.6,14.37 JP3.1
N$11
  Top 1.27: T1.B 34.47,30.3 34.92,29.84 36.66,29.84 R18.2 R19.1
N$12
  Top 1.016: T1.C 30.98,31.25 30.1,32.13 D2.A
  Top 1.27: K1.5 27.7,33.42 28.57,34.29 29.96,34.29 D2.A
N$13
  Top 0.61: U8.5 112.76,9.78 C19.2
N$14  (via drill 3 pad 4)
  other vias: 118,65
N$15
  Top 0.406: Q1.B 47.95,54.29 46.35,55.88
  Top 0.813: D6.C 46.38,57.25 | 45.98,56.26 46.35,55.88
  Top 1.27: J2.2 45.38,56.26 | 45.38,56.26 46.38,57.25 | 45.38,56.26 45.98,56.26
N$16
  Top 1.27: 9.03,38.73 9.03,37.33 12.46,33.89 K1.7
  Top 1.422: J1.3 6.53,44.16 9.03,41.66 9.03,38.73
N$17  (via drill 0.51)
  Top 0.203: 100.61,8.26 100.4,8.26 R26.1
  Top 0.406: 103.89,12.32 U8.2 105.13,12.38 v103.03,12.38 | v105.41,8.26 107.02,8.26
  Top 0.61: U8.6 108.84,11.05 108.58,10.79 108.58,10.16 107.02,8.6 107.02,8.26 R27.2 106.94,5.26 104.74,5.26 C17.+ 104.53,7.86 104.14,8.26 100.61,8.26
  Bottom 0.406: v105.41,8.26 105.41,10.79 103.89,12.32 103.09,12.32 v103.03,12.38
N$18
  Top 0.813: D6.A D5.C
N$19
  Top 0.61: U8.7 111.38,12.32 111.76,12.7 113.39,12.7 R28.2 116.81,12.73 118.11,11.43 118.11,8.26 117.79,7.94 116.52,7.94 113.92,5.33 R27.1
N$20
  Top 1.27: T2.B 36.74,17.96 R22.2 R24.1
N$21
  Top 1.016: D4.A 31.37,23.88 32.3,22.95 T2.C
  Top 1.27: 30.23,23.99 D4.A 30.12,22.5 29.43,21.81 K2.5
N$22
  Top 0.203: U7.56 92.73,23.5 C24.2
N$23
  Top 1.27: 9.66,32.13 9.66,18.05 K2.1
  Top 1.422: J1.5 7.64,34.16 9.66,32.13
N$24
  Top 0.813: R38.2 LED2.A
N$25
  Top 1.067: R25.2 50.46,26.54 LED1.A
N$26
  Top 1.016: F3.2 36.09,12.56 D3.A 36.09,10.9 36.2,10.79 42.55,10.79 42.97,11.22 T3.3
N$27
  Top 0.305: C12.2 51.4,35.31 50.16,36.54 U5.9
N$28
  Top 0.254: U5.1 46.49,32.35 46.58,32.26 47.02,32.26 47.15,32.13 | 47.85,32.41 47.49,32.77 U5.3 U5.2
  Top 0.813: U5.2 46.99,32.28 47.02,32.26
  Top 1.778: L1.P$1 47.15,32.13 47.14,32.13
N$29
  Top 0.2: U7.19 78.43,26.5 77.85,27.08 77.69,27.08
  Top 0.254: C20.1 77.69,27.08
  Top 0.813: L2.1 75.72,27.07 C20.1
  Top 1.016: 76.04,27.07 C20.1
N$30
  Top 1.016: T3.1 47.25,11.26 R20.2 49.48,11.14 R21.1
N$31
  Top 0.813: T4.3 52.76,11.57 R21.2
PIN9/WATCHDOG
  Top 0.203: U7.48 88.7,16.71 88.9,16.51
  Top 0.406: 88.9,16.51 89.38,16.51 90.01,15.88 90.01,13.49 90.49,13.02 94.93,13.02 97.38,10.57 R26.2
PIN10
  Top 0.254: U7.49 93.67,20
  Top 0.406: 93.67,20 94.3,20
PIN13/VERSION_CONTROL_1
  Top 0.254: U7.52 96.59,21.5 97.95,22.86 97.95,34.92 97.47,35.4 R45.2
PIN14/VERSION_CONTROL_2
  Top 0.254: U7.53 96.3,22 97.47,23.18 97.47,32.86 97.31,33.02 R44.2
PIN15/VERSION_CONTROL_3
  Top 0.254: U7.54 95.89,22.5 96.2,22.81 R43.2
PIN27/RAIN2  (via drill 0.6)
  Top 0.254: U7.4 87.2,28.69 87.31,28.57 89.06,28.57 89.22,28.73 89.22,31.27 89.38,31.43 89.38,37.94 89.69,38.26
  Top 0.406: 89.69,38.26 90.81,39.37 101.6,39.37 103.82,41.59 105.73,41.59 106.05,41.91 106.05,43.5 105.57,43.97 v105.09,43.97 | v102.39,43.97 102.08,43.97 101.6,44.45 R41.1
  Bottom 0.406: v105.09,43.97 v102.39,43.97
PIN28/RAIN1
  Top 0.254: U7.5 86.7,31.14 87.15,31.59 87.15,32.07 87.63,32.54 87.63,39.85 87,40.48 R42.1
PIN36/RAIN3  (via drill 0.6)
  Top 0.254: U7.16 80.83,29.5 79.69,30.64 79.69,35.72 79.53,35.88 v79.53,39.85
  Top 0.406: R40.1 68.58,40.01 69.22,39.37 76.2,39.37 v76.68,39.85
  Bottom 0.406: v76.68,39.85 v79.53,39.85
PIN37/PGC
  Top 0.254: U7.17 79.2,27.8 77.79,29.21 75.56,29.21 74.55,30.23 JP4.5
PIN38/PGD
  Top 0.2: U7.18 78.59,27 78.58,26.99 78.26,27.3
  Top 0.254: JP4.4 72.39,30.88 72.39,30.48 74.3,28.57 76.99,28.57 78.26,27.3
PIN39/WINDVANE_DETECTION  (via drill 0.6)
  Top 0.2: U7.21 78.48,25.5 77.79,26.19 v77.47,26.19
  Top 0.406: v60.01,29.21 59.69,29.53 59.69,34.61 55.24,39.05 52.86,39.05 50.64,41.27 50.64,46.04 v50.32,46.2 | 51.12,51.28 50.96,51.28 v50.64,50.96
  Top 0.813: R39.2 51.58,51.73 51.12,51.28 Q1.C
  Bottom 0.254: v77.47,26.19 76.99,26.19 76.2,25.4 65.72,25.4 65.41,25.72 63.18,25.72 60.64,28.26 60.64,28.57 v60.01,29.21
  Bottom 0.406: v50.32,46.2 50.32,50.8 v50.64,50.96
PIN40/ANEMOMETER_SWITCH  (via drill 0.51)
  Top 0.254: U7.22 77.7,25 v77.63,24.92 | 59.05,28.57 v59.69,27.94
  Top 0.406: 59.05,28.57 59.05,34.29 54.93,38.42 52.39,38.42 46.51,44.29 46.51,46.83 45.72,47.62 45.35,47.62 R12.1
  Bottom 0.254: v59.69,27.94 60.17,27.94 62.87,25.24 65.09,25.24 65.41,24.92 v77.63,24.92
PIN41/AZIMUTH  (via drill 0.51)
  Top 0.2: U7.23 78.32,24.5 77.79,23.97 77.63,23.97 | 74.93,23.97 74.61,23.97 74.45,24.13
  Top 0.203: 77.63,23.97 74.93,23.97
  Top 0.254: v63.5,24.13 64.45,25.08 73.5,25.08 74.45,24.13 | 58.42,28.57 58.42,27.62 59.05,26.99 59.37,26.99 v59.69,26.67
  Top 0.406: 58.42,28.57 58.42,33.97 54.61,37.78 51.75,37.78 45.09,44.45 45.09,45.45 R5.1
  Bottom 0.254: v63.5,24.13 62.23,24.13 v59.69,26.67
PIN42/SUPPLY  (via drill 0.51)
  Top 0.2: U7.24 78.45,24 78.26,23.81 78.26,23.5 78.11,23.34 77.63,23.34
  Top 0.203: 77.63,23.34 74.61,23.34
  Top 0.254: v64.77,24.13 65.25,24.61 73.18,24.61 74.45,23.34 74.61,23.34 | v59.69,25.4 57.78,27.3 57.78,28.57
  Top 0.406: R16.2 47.22,41.05 51.12,37.15 54.29,37.15 57.78,33.66 57.78,28.57
  Top 1.016: R16.2 39.19,43.24 R17.1
  Bottom 0.254: v64.77,24.13 63.82,23.18 62.39,23.18 60.17,25.4 v59.69,25.4
PIN45/REL1  (via drill 0.51)
  Top 0.254: U7.29 77.86,21.5 v77.63,21.27
  Top 0.406: R18.1 39.65,28.22 v39.37,27.94 | v39.37,24.77 39.37,23.5 44.45,18.41 52.07,18.41 52.7,17.78 73.5,17.78 73.88,18.16 v74.45,18.16
  Bottom 0.406: v39.37,27.94 v39.37,24.77 | v77.63,21.27 77.56,21.27 v74.45,18.16
PIN46/REL2  (via drill 0.51)
  Top 0.254: U7.30 78.47,21 v77.63,20.1
  Top 0.406: v74.45,16.99 52.23,16.99 51.58,17.64 R22.1
  Bottom 0.406: v74.45,16.99 74.83,16.99 75.82,17.97 75.82,18.29 v77.63,20.1
RAIN1  (via drill 0.6)
  Top 0.406: C28.2 v85.09,45.09 R42.2
  Bottom 0.406: 80.64,52.7 85.09,48.26 v85.09,45.09
  Bottom 1.016: J4.2 79.63,53.72 80.64,52.7
RAIN2  (via drill 0.6)
  Top 0.406: v103.5,48.9 103.02,48.41 R41.2 101.63,48.44 C27.2
  Bottom 0.406: 96.84,53.02 100.33,49.53 102.87,49.53 v103.5,48.9
  Bottom 1.016: J5.2 96.14,53.72 96.84,53.02
RAIN3  (via drill 0.6)
  Top 0.406: R40.2 v68.58,45.4 C26.2
  Bottom 0.406: 63.5,53.34 68.58,48.26 v68.58,45.4
  Bottom 1.27: J6.2 63.12,53.72 63.5,53.34
SCL1  (via drill 0.51)
  Top 0.203: U7.44 86.7,19.23 87,19.53 v87.63,19.53
  Top 0.254: 93.34,18.41 90.01,18.41 88.9,19.53 v87.63,19.53 | v87.63,21.11 87.63,21.43 86.52,22.54 84.93,22.54 83.34,24.13 83.34,27.46 v82.87,27.94 | 80.33,39.05 80.01,38.73 80.01,36.2 80.17,36.04 80.17,31.59 v80.96,30.8
  Top 0.406: R7.1 82.32,42.77 | SV1.3 114.64,38.48 R30.2 113.32,38.39 111.92,36.99 109.38,36.99 101.6,29.21 101.6,19.68 100.33,18.41 93.34,18.41 | U1.6 80.9,44.2 81.28,43.81 81.28,43.18 81.69,42.77 82.32,42.77 | 82.32,42.77 82.55,42.55 82.55,41.27 80.33,39.05
  Bottom 0.203: v87.63,19.53 v87.63,21.11
  Bottom 0.254: v80.96,30.8 80.96,29.84 v82.87,27.94
SCL2  (via drill 0.51)
  Top 0.254: U7.32 80.48,20 81.28,20.8 81.28,21.59 v81.92,22.23 81.92,23.34 82.39,23.81 82.39,26.35 78.74,30 78.74,35.08 78.58,35.24 78.58,38.26 78.11,38.73 | 93.34,17.14 91.12,17.14 v90.96,16.99
  Top 0.406: 78.11,38.73 67.94,38.73 66.18,40.5 R11.1 65.18,42.77 64.77,43.18 64.77,43.81 64.39,44.2 U3.6 | SV3.3 114.64,25.78 R31.2 113.32,25.69 113.03,25.4 113.03,24.92 112.39,24.29 108.11,24.29 100.97,17.14 93.34,17.14
  Bottom 0.254: v81.92,22.23 82.07,22.23 85.88,18.41 90.49,18.41 90.96,17.94 v90.96,16.99
SCL3  (via drill 0.51)
  Top 0.254: U7.2 88.2,31.05 88.9,31.75 88.9,38.73
  Top 0.406: R32.2 114.56,52.33 115.89,53.66 115.89,60.01 113.92,61.98 U6.8 | SV2.3 114.64,51.18 R32.2 | R32.2 113.16,51.09 112.71,50.64 112.71,50.32 112.08,49.69 108.74,49.69 104.14,45.09 104.14,42.86 | U2.6 97.41,44.2 97.79,43.81 97.79,43.18 98.2,42.77 R9.1 101.53,42.77 v101.6,42.7 | 88.9,38.73 90.17,40.01 101.28,40.01 104.14,42.86 | 104.14,42.86 104.93,42.86 v105.09,42.7
  Bottom 0.406: v105.09,42.7 v101.6,42.7
SDA1
  Top 0.203: U7.43 86.2,19.52 86.68,20 86.68,20.32
  Top 0.254: 93.34,19.05 90.17,19.05 88.9,20.32 86.68,20.32 86.68,21.59 86.2,22.07 84.61,22.07 82.87,23.81 82.87,26.67 79.22,30.32 79.22,35.4 79.06,35.56 79.06,39.05 78.74,39.37
  Top 0.406: R6.1 72.3,43.41 73.09,44.2 U1.3 76.45,44.2 77.47,43.18 77.47,40.64 78.74,39.37 | SV1.2 112.14,41.02 110.75,39.62 R33.2 109.51,38.39 100.97,29.84 100.97,20.32 99.69,19.05 93.34,19.05
SDA2  (via drill 0.51)
  Top 0.254: U7.31 80.19,20.5 80.64,20.95 v80.64,22.23 80.64,22.86 81.92,24.13 81.92,26.04 78.26,29.69 78.26,34.77 78.11,34.92 78.11,37.47 77.47,38.1 | v89.69,17.62 90.01,17.62 90.17,17.78 93.34,17.78
  Top 0.406: 77.47,38.1 65.41,38.1 59.31,44.2 U3.3 56.42,44.2 55.63,43.41 R10.1 | SV3.2 112.14,28.32 110.75,26.93 R34.2 108.24,25.69 102.23,19.68 102.23,19.37 100.65,17.78 93.34,17.78
  Bottom 0.254: v89.69,17.62 89.06,17.62 88.74,17.94 85.57,17.94 82.39,21.11 81.76,21.11 v80.64,22.23
SDA3  (via drill 0.51)
  Top 0.254: U7.3 87.7,31.82 88.27,32.38 88.27,39.37
  Top 0.406: R8.1 88.81,43.41 89.6,44.2 U2.3 92.97,44.2 93.98,43.18 93.98,40.64 | 93.98,40.64 100.97,40.64 103.5,43.18 103.5,45.56 109.04,51.09 R29.2 110.75,52.96 111.76,53.98 v113.03,53.98 114.3,53.98 114.94,54.61 114.94,59.69 113.92,60.7 U6.7 | 93.98,40.64 89.53,40.64 88.27,39.37
  Bottom 0.406: SV2.2 113.28,53.72 v113.03,53.98
TEMP1/SCL1  (via drill 0.51)
  Top 0.406: v74.93,48.26 77.72,45.47 U1.7 82.54,45.47 R7.2 R13.2
  Bottom 0.406: v74.93,48.26 74.93,48.74 74.61,49.05 74.61,51.28 76.2,52.86
  Bottom 1.016: J4.4 76.97,53.64 76.2,52.86
TEMP2/SCL2  (via drill 0.51)
  Top 0.406: R14.2 R9.2 99.05,45.47 U2.7 94.23,45.47 92.55,47.15 92.55,47.78 v92.08,48.26
  Bottom 0.406: v92.08,48.26 91.28,49.05 91.28,51.44 92.87,53.02
  Bottom 1.016: J5.4 93.48,53.64 92.87,53.02
TEMP3/SCL3  (via drill 0.51)
  Top 0.406: v58.42,48.26 61.22,45.47 U3.7 66.03,45.47 R11.2 R15.2
  Bottom 0.406: 59.69,52.7 58.26,51.28 58.26,49.05 58.42,48.9 v58.42,48.26
  Bottom 1.016: J6.4 60.47,53.48 59.69,52.7
USB+
  Top 0.254: U7.36 82.7,16.02 81.92,15.24 81.92,14.61
  Top 0.406: J7.D- 6.75,10.55 6.99,10.79 7.62,10.79
  Top 1.016: 9.53,10.79 10.79,10.79
  Top 1.067: 7.62,10.79 9.53,10.79 | 10.79,10.79 15.24,6.35 80.64,6.35 81.92,7.62 81.92,14.61
USB-
  Top 0.254: U7.37 83.2,14.62 83.19,14.61
  Top 0.406: J7.D+ 6.61,9.9 6.99,9.53 7.62,9.53
  Top 1.016: 9.53,9.53 10.16,9.53
  Top 1.067: 7.62,9.53 9.53,9.53 | 10.16,9.53 14.61,5.08 81.28,5.08 83.19,6.99 83.19,14.61
USBID  (via drill 0.51)
  Top 0.254: v78.74,17.78 78.96,18 79.44,18 79.53,18.1 81.1,18.1 U7.33
  Top 0.406: R37.1 9.53,4.57 9.53,6.35 8.89,6.99 6.99,6.99 6.35,7.62 6.35,8.89 5.99,9.26 J7.ID 3.76,9.26 3.49,9.53 3.49,11.75 3.81,12.06 5.71,12.06 7.22,13.57 7.3,13.49 13.81,13.49 15.4,11.91 28.1,11.91 30.16,13.97 32.38,13.97 32.7,13.65 32.7,11.11 34.29,9.53 72.39,9.53 v76.2,13.34
  Bottom 0.254: v78.74,17.78 78.11,17.14 78.11,15.24 v76.2,13.34
V+
  Top 1.27: F1.2 20.32,38.13 20.32,33.73 K1.1 12.46,22.02 K2.7
VBUS  (via drill 0.51)
  Top 0.254: U7.34 81.7,17.25 81.44,16.99 80.33,16.99 v80.01,17.3
  Top 0.406: J7.VBUS 6.12,11.21 7.62,12.7 13.34,12.7 15.56,10.48 | 15.56,10.48 17.14,8.89 73.66,8.89 v77.47,12.7 | 31.36,12.7 F3.1 | 15.56,10.48 15.88,10.79
  Top 1.016: 31.36,12.7 30.48,12.7 28.57,10.79 15.88,10.79
  Bottom 0.254: v80.01,17.3 79.53,17.3 78.8,16.57 78.8,15.24 77.47,13.91 v77.47,12.7
(copper drawn outside any net)
  shapes: Top circle x2

### Text on the board
tNames: 2A time lag | ANEMOMETER | SENSOR A | SENSOR B | SENSOR C | 0,5A | I2C_A | V- | Vin+ | SDA | SCL | Vin- | V+ | I2C_B | V- | Vin+ | Out1+ | Vin- | Out1+ | Out1- | SDA | Out1- | Out2+ | MCLR | Out2- | VCC | GND | SCL | V+ | Out2+ | PIN38/PGD | PIN37/PGC | I2C_C | V- | Out2- | SDA | SCL | V+ | MCLR | WATCHDOG RESET | GND | BOOT | TNA Software R4A-2015
bNames: TNA Software R4A-2015